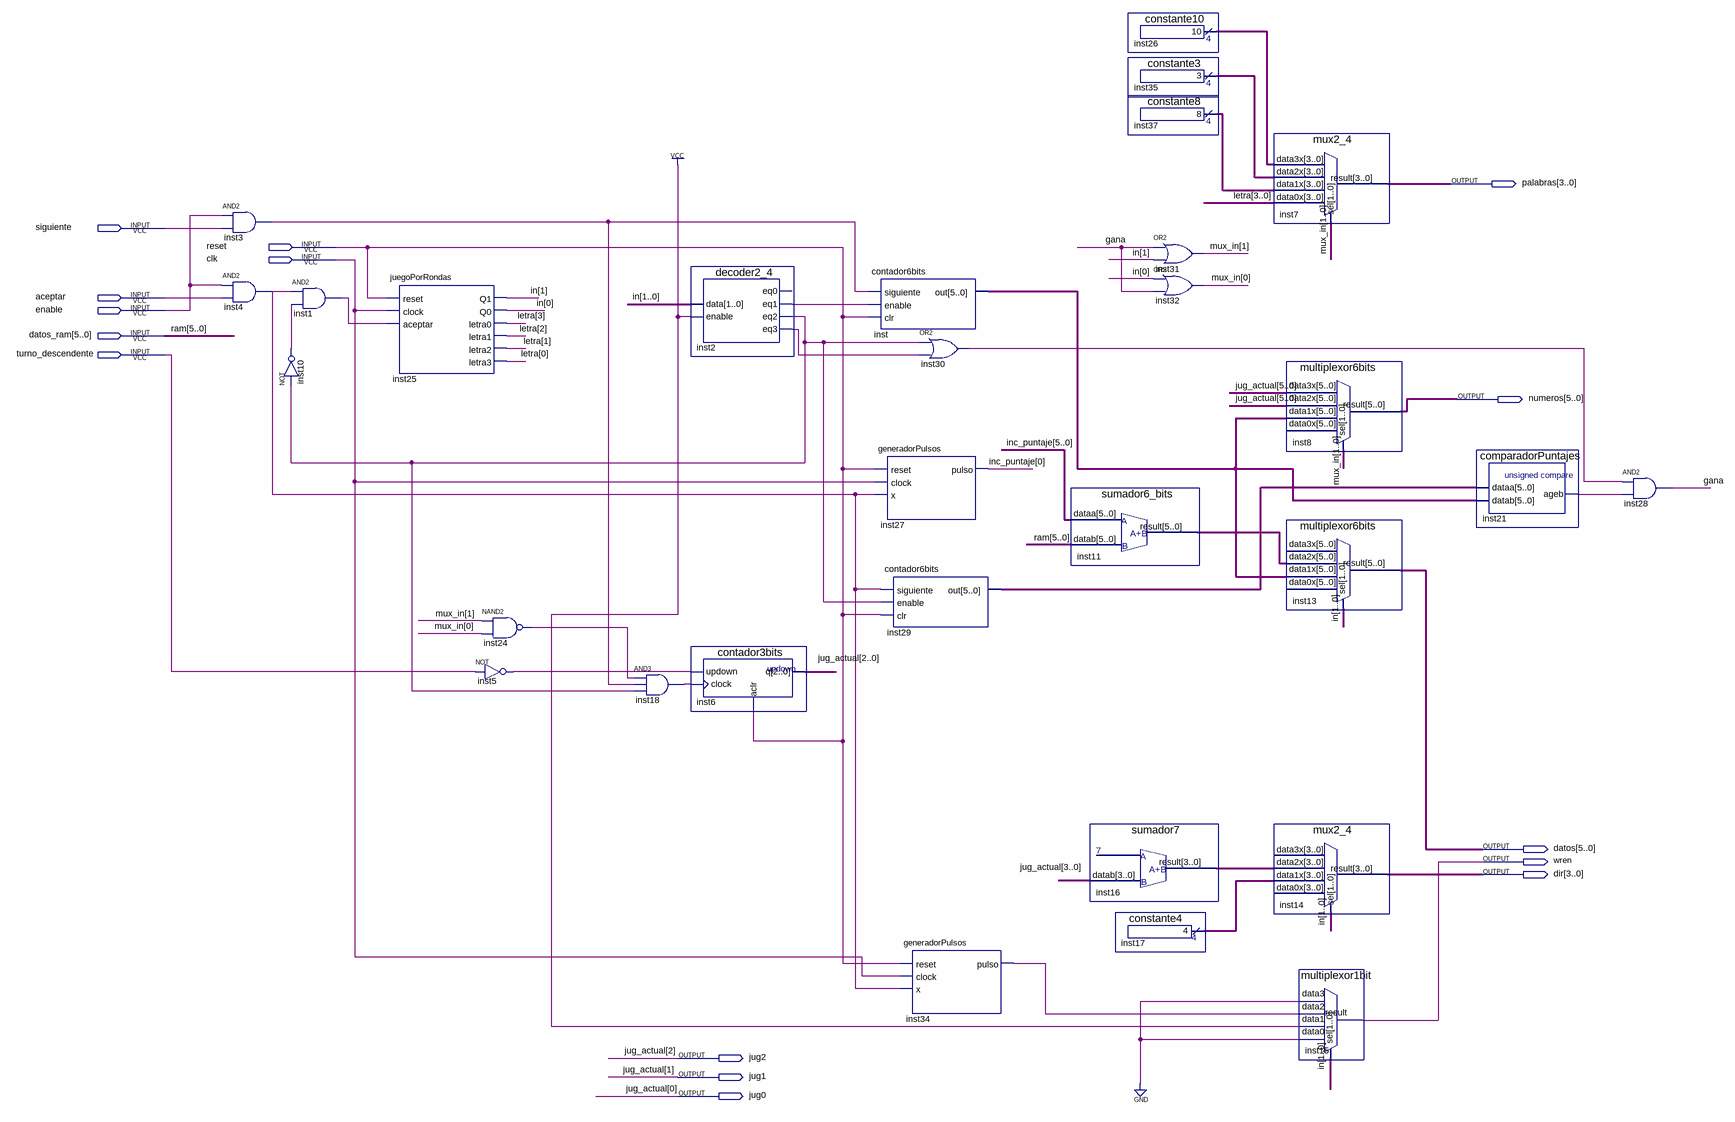
[diagram p0: schematic sheet]
// Quartus schematic juego_rondas.bdf as structural Verilog: 30 symbols, 15 pins
module juego_rondas (
  input  siguiente,
  input  reset,
  input  clk,
  input  aceptar,
  input  enable,
  input  [5:0] datos_ram,
  input  turno_descendente,
  output [3:0] palabras,
  output [5:0] numeros,
  output [5:0] datos,
  output wren,
  output [3:0] dir,
  output jug2,
  output jug1,
  output jug0
);

  wire gana, inst1_out, inst2_eq1, inst2_eq2, inst2_eq3, inst3_out, inst4_out, inst5_out, inst10_out,
       inst18_out, inst21_ageb, inst24_out, inst30_out, inst34_pulso;
  wire [1:0] in, mux_in;
  wire [3:0] inst16_result, inst17_result, inst26_result, inst35_result, inst37_result, letra;
  wire [5:0] inc_puntaje, inst11_result, inst29_out, inst_out;
  wire [5:3] jug_actual;

  and inst3 (inst3_out, enable, siguiente);
  and inst4 (inst4_out, enable, aceptar);
  not inst10 (inst10_out, inst2_eq2);
  and inst1 (inst1_out, inst4_out, inst10_out);
  juegoPorRondas inst25 (
    .reset(reset), .clock(clk), .aceptar(inst1_out), .Q1(in[1]), .Q0(in[0]), .letra0(letra[3]),
    .letra1(letra[2]), .letra2(letra[1]), .letra3(letra[0]));
  nand inst24 (inst24_out, mux_in[1], mux_in[0]);
  not inst5 (inst5_out, turno_descendente);
  and inst18 (inst18_out, inst24_out, inst3_out, inst2_eq2);
  decoder2_4 inst2 (.data(in), .enable(1'b1), .eq1(inst2_eq1), .eq2(inst2_eq2), .eq3(inst2_eq3));  // open: eq0
  contador3bits inst6 (.updown(inst5_out), .clock(inst18_out), .aclr(reset), .q({jug2, jug1, jug0}));
  contador6bits inst (.siguiente(inst3_out), .enable(inst2_eq1), .clr(reset), .out(inst_out));
  generadorPulsos inst27 (.reset(reset), .clock(clk), .x(inst4_out), .pulso(inc_puntaje[0]));
  contador6bits inst29 (.siguiente(inst4_out), .enable(inst2_eq2), .clr(reset), .out(inst29_out));
  or inst30 (inst30_out, inst2_eq2, inst2_eq3);
  generadorPulsos inst34 (.reset(reset), .clock(clk), .x(inst4_out), .pulso(inst34_pulso));
  sumador6_bits inst11 (.dataa(inc_puntaje), .datab(datos_ram), .result(inst11_result));
  sumador7 inst16 (.datab({jug_actual[3], jug2, jug1, jug0}), .result(inst16_result));
  constante10 inst26 (.result(inst26_result));
  constante3 inst35 (.result(inst35_result));
  constante8 inst37 (.result(inst37_result));
  constante4 inst17 (.result(inst17_result));
  or inst31 (mux_in[1], gana, in[1]);
  or inst32 (mux_in[0], in[0], gana);
  mux2_4 inst7 (
    .data3x(inst26_result), .data2x(inst35_result), .data1x(inst37_result), .data0x(letra), .sel(mux_in),
    .result(palabras));
  multiplexor6bits inst8 (
    .data3x({jug_actual, jug2, jug1, jug0}), .data2x({jug_actual, jug2, jug1, jug0}), .data1x(inst_out),
    .sel(mux_in), .result(numeros));  // open: data0x
  multiplexor6bits inst13 (
    .data2x(inst11_result), .data1x(inst_out), .sel(in), .result(datos));  // open: data3x, data0x
  mux2_4 inst14 (.data2x(inst16_result), .data1x(inst17_result), .sel(in), .result(dir));  // open: data3x, data0x
  multiplexor1bit inst15 (.data3(1'b0), .data2(inst34_pulso), .data1(1'b1), .data0(1'b0), .sel(in), .result(wren));
  comparadorPuntajes inst21 (.dataa(inst29_out), .datab(inst_out), .ageb(inst21_ageb));
  and inst28 (gana, inst30_out, inst21_ageb);

  // Other names for the same wires on the sheet: jug_actual[2:0] = {jug2, jug1, jug0}; ram[5:0] = datos_ram
endmodule
